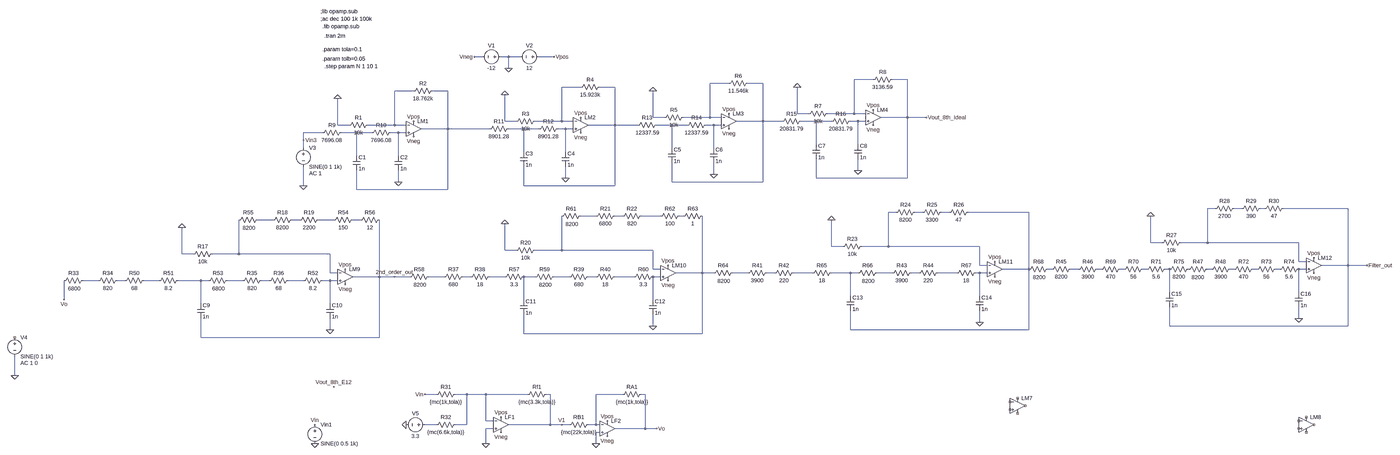
[diagram p0: schematic ESP Prac 1 Chebyshev 8th order Anti-Aliasing Filter.asc, whole sheet]
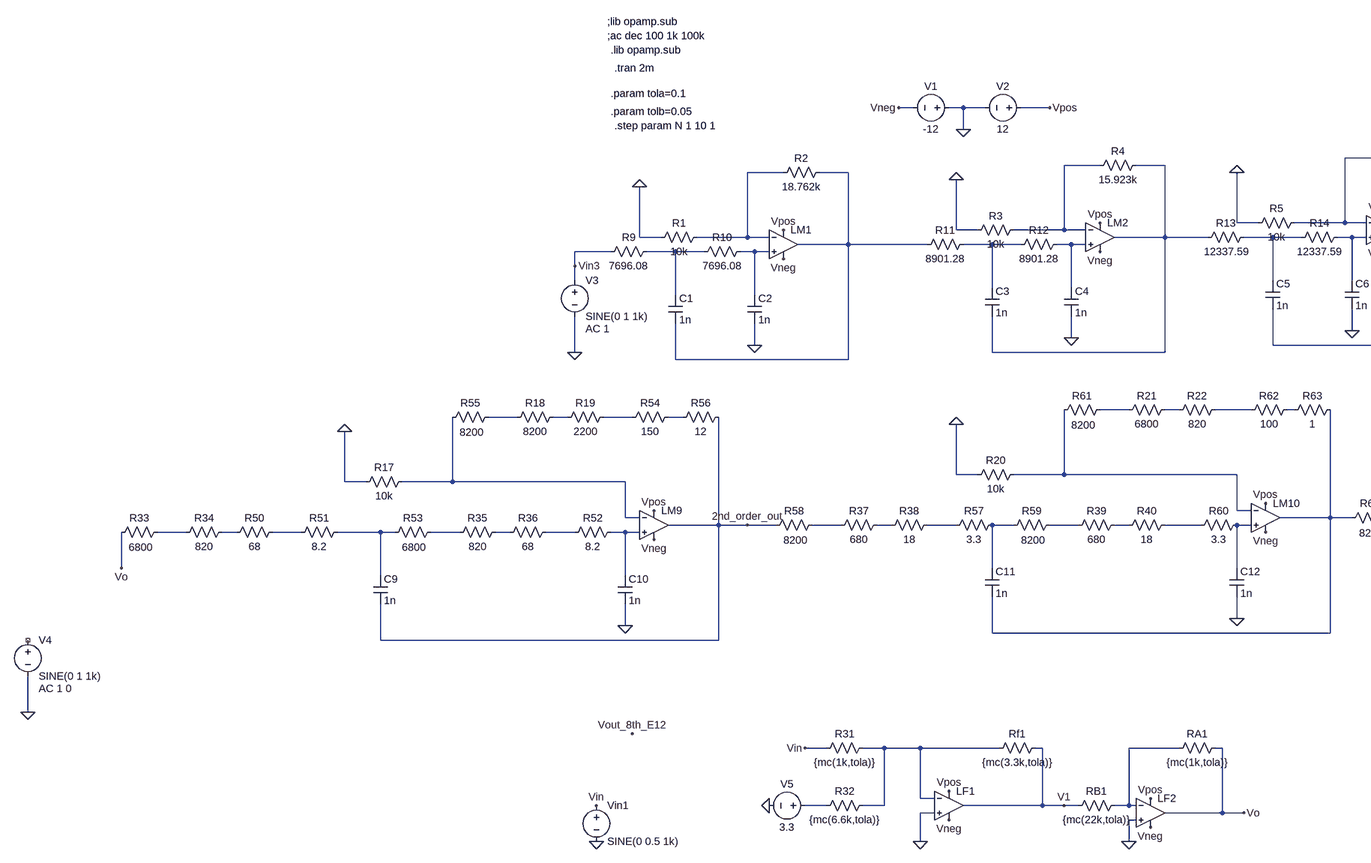
[diagram p1: schematic ESP Prac 1 Chebyshev 8th order Anti-Aliasing Filter.asc, part, row 1 of 1, column 1 of 2]
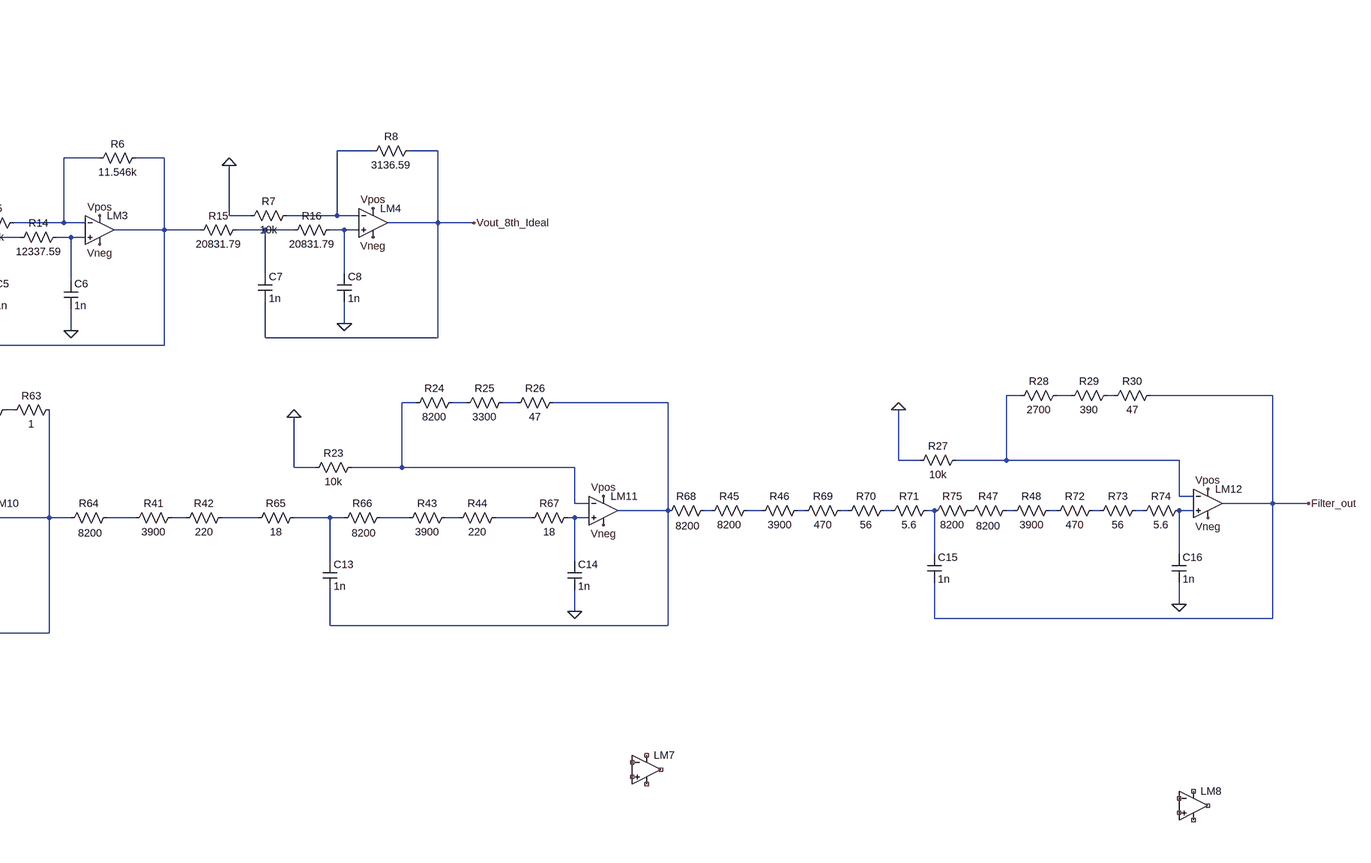
[diagram p2: schematic ESP Prac 1 Chebyshev 8th order Anti-Aliasing Filter.asc, part, row 1 of 1, column 2 of 2]
ESP Prac 1 Chebyshev 8th order Anti-Aliasing Filter.asc, the LTspice schematic file:
Version 4
SHEET 1 3480 1720
WIRE -432 16 -464 16
WIRE -320 16 -352 16
WIRE -272 16 -320 16
WIRE -128 16 -192 16
WIRE -320 64 -320 16
WIRE 1216 112 1136 112
WIRE 1360 112 1296 112
WIRE 608 128 528 128
WIRE 752 128 688 128
WIRE -16 144 -96 144
WIRE 128 144 64 144
WIRE -720 160 -800 160
WIRE -576 160 -640 160
WIRE 896 256 896 144
WIRE 944 256 896 256
WIRE 1136 256 1136 112
WIRE 1136 256 1024 256
WIRE 1184 256 1136 256
WIRE 288 272 288 160
WIRE 336 272 288 272
WIRE 528 272 528 128
WIRE 528 272 416 272
WIRE 576 272 528 272
WIRE 1360 272 1360 112
WIRE 1360 272 1248 272
WIRE 1440 272 1360 272
WIRE -336 288 -336 176
WIRE -288 288 -336 288
WIRE -96 288 -96 144
WIRE -96 288 -208 288
WIRE -48 288 -96 288
WIRE 752 288 752 128
WIRE 752 288 640 288
WIRE 832 288 752 288
WIRE 976 288 912 288
WIRE 1040 288 976 288
WIRE 1152 288 1120 288
WIRE 1184 288 1152 288
WIRE -1040 304 -1040 192
WIRE -992 304 -1040 304
WIRE -800 304 -800 160
WIRE -800 304 -912 304
WIRE -752 304 -800 304
WIRE 128 304 128 144
WIRE 128 304 16 304
WIRE 224 304 128 304
WIRE 368 304 304 304
WIRE 432 304 368 304
WIRE 544 304 512 304
WIRE 576 304 544 304
WIRE -576 320 -576 160
WIRE -576 320 -688 320
WIRE -400 320 -576 320
WIRE -256 320 -320 320
WIRE -192 320 -256 320
WIRE -80 320 -112 320
WIRE -48 320 -80 320
WIRE -1104 336 -1184 336
WIRE -960 336 -1024 336
WIRE -896 336 -960 336
WIRE -784 336 -816 336
WIRE -752 336 -784 336
WIRE -1184 368 -1184 336
WIRE 976 384 976 288
WIRE 1152 384 1152 288
WIRE -1184 400 -1184 368
WIRE 368 400 368 304
WIRE 544 400 544 304
WIRE -256 416 -256 320
WIRE -80 416 -80 320
WIRE -960 432 -960 336
WIRE -784 432 -784 336
WIRE 1152 496 1152 448
WIRE 544 512 544 464
WIRE -80 528 -80 480
WIRE 976 528 976 448
WIRE 1360 528 1360 272
WIRE 1360 528 976 528
WIRE -784 544 -784 496
WIRE 368 544 368 464
WIRE 752 544 752 288
WIRE 752 544 368 544
WIRE -1184 560 -1184 480
WIRE -256 560 -256 480
WIRE 128 560 128 304
WIRE 128 560 -256 560
WIRE -960 576 -960 496
WIRE -576 576 -576 320
WIRE -576 576 -960 576
WIRE 2656 656 2624 656
WIRE 2768 656 2736 656
WIRE 2864 656 2848 656
WIRE 3216 656 2944 656
WIRE 1312 672 1280 672
WIRE 1424 672 1392 672
WIRE 1536 672 1504 672
WIRE 1872 672 1616 672
WIRE 48 688 -16 688
WIRE 160 688 128 688
WIRE 320 688 240 688
WIRE 416 688 400 688
WIRE -1312 704 -1376 704
WIRE -1200 704 -1232 704
WIRE -1056 704 -1120 704
WIRE -944 704 -976 704
WIRE 2384 800 2384 688
WIRE 2432 800 2384 800
WIRE 2624 800 2624 656
WIRE 2624 800 2512 800
WIRE 3008 800 2624 800
WIRE 1040 816 1040 704
WIRE 1088 816 1040 816
WIRE 1280 816 1280 672
WIRE 1280 816 1168 816
WIRE 1664 816 1280 816
WIRE -336 832 -336 720
WIRE -288 832 -336 832
WIRE -96 832 -96 688
WIRE -96 832 -208 832
WIRE 288 832 -96 832
WIRE -1696 848 -1696 736
WIRE -1648 848 -1696 848
WIRE -1456 848 -1456 704
WIRE -1456 848 -1568 848
WIRE -1072 848 -1456 848
WIRE 3008 880 3008 800
WIRE 3040 880 3008 880
WIRE 1664 896 1664 816
WIRE 1696 896 1664 896
WIRE 3216 896 3216 656
WIRE 3216 896 3104 896
WIRE 3296 896 3216 896
WIRE 288 912 288 832
WIRE 320 912 288 912
WIRE 1872 912 1872 672
WIRE 1872 912 1760 912
WIRE 1968 912 1952 912
WIRE 2080 912 2048 912
WIRE 2176 912 2160 912
WIRE 2272 912 2256 912
WIRE 2368 912 2352 912
WIRE 2464 912 2448 912
WIRE 2640 912 2624 912
WIRE 2736 912 2720 912
WIRE 2832 912 2816 912
WIRE 2928 912 2912 912
WIRE 3040 912 3008 912
WIRE -1072 928 -1072 848
WIRE -1040 928 -1072 928
WIRE 496 928 496 688
WIRE 496 928 384 928
WIRE 544 928 496 928
WIRE 688 928 624 928
WIRE 800 928 768 928
WIRE 960 928 880 928
WIRE 1120 928 1040 928
WIRE 1152 928 1120 928
WIRE 1296 928 1232 928
WIRE 1408 928 1376 928
WIRE 1568 928 1488 928
WIRE 1664 928 1648 928
WIRE 1696 928 1664 928
WIRE -864 944 -864 704
WIRE -864 944 -976 944
WIRE -800 944 -864 944
WIRE -736 944 -800 944
WIRE -592 944 -656 944
WIRE -480 944 -512 944
WIRE -336 944 -400 944
WIRE -208 944 -256 944
WIRE -64 944 -128 944
WIRE 48 944 16 944
WIRE 208 944 128 944
WIRE 320 944 288 944
WIRE -2048 960 -2112 960
WIRE -1936 960 -1968 960
WIRE -1792 960 -1856 960
WIRE -1616 960 -1712 960
WIRE -1584 960 -1616 960
WIRE -1440 960 -1504 960
WIRE -1328 960 -1360 960
WIRE -1184 960 -1248 960
WIRE -1072 960 -1104 960
WIRE -1040 960 -1072 960
WIRE 2464 1008 2464 912
WIRE 3008 1008 3008 912
WIRE 1120 1024 1120 928
WIRE 1664 1024 1664 928
WIRE -2192 1040 -2192 960
WIRE -256 1040 -256 944
WIRE 288 1040 288 944
WIRE -1616 1056 -1616 960
WIRE -1072 1056 -1072 960
WIRE 3008 1120 3008 1072
WIRE 1664 1136 1664 1088
WIRE 288 1152 288 1104
WIRE 2464 1152 2464 1072
WIRE 3216 1152 3216 896
WIRE 3216 1152 2464 1152
WIRE -1072 1168 -1072 1120
WIRE 1120 1168 1120 1088
WIRE 1872 1168 1872 912
WIRE 1872 1168 1120 1168
WIRE -256 1184 -256 1104
WIRE 496 1184 496 928
WIRE 496 1184 -256 1184
WIRE -1616 1200 -1616 1120
WIRE -864 1200 -864 944
WIRE -864 1200 -1616 1200
WIRE -2400 1360 -2400 1280
WIRE -624 1440 -672 1440
WIRE -496 1440 -544 1440
WIRE -416 1440 -496 1440
WIRE -240 1440 -416 1440
WIRE -144 1440 -160 1440
WIRE 160 1440 48 1440
WIRE 256 1440 240 1440
WIRE -416 1552 -416 1440
WIRE -384 1552 -416 1552
WIRE -624 1568 -672 1568
WIRE -496 1568 -496 1440
WIRE -496 1568 -544 1568
WIRE -144 1568 -144 1440
WIRE -144 1568 -320 1568
WIRE -96 1568 -144 1568
WIRE -64 1568 -96 1568
WIRE 48 1568 48 1440
WIRE 48 1568 16 1568
WIRE 64 1568 48 1568
WIRE -384 1584 -416 1584
WIRE 256 1584 256 1440
WIRE 256 1584 128 1584
WIRE 304 1584 256 1584
WIRE 64 1600 48 1600
WIRE -416 1648 -416 1584
WIRE 48 1648 48 1600
FLAG -320 64 0
FLAG -128 16 Vpos
FLAG -464 16 Vneg
FLAG -784 544 0
FLAG -1040 192 0
FLAG -1184 560 0
FLAG -80 528 0
FLAG -336 176 0
FLAG 544 512 0
FLAG 288 160 0
FLAG 1152 496 0
FLAG 896 144 0
FLAG -720 288 Vpos
FLAG -16 272 Vpos
FLAG 608 256 Vpos
FLAG 1216 240 Vpos
FLAG 1216 304 Vneg
FLAG 608 320 Vneg
FLAG -16 336 Vneg
FLAG -720 352 Vneg
FLAG 1440 272 Vout_8th_Ideal
FLAG -1184 368 Vin3
FLAG -1072 1168 0
FLAG -1696 736 0
FLAG -2400 1360 0
FLAG -1008 976 Vneg
FLAG -1008 912 Vpos
FLAG 288 1152 0
FLAG -336 720 0
FLAG 352 960 Vneg
FLAG 352 896 Vpos
FLAG 1664 1136 0
FLAG 1040 704 0
FLAG 1728 944 Vneg
FLAG 1728 880 Vpos
FLAG 3008 1120 0
FLAG 2384 688 0
FLAG 3072 928 Vneg
FLAG 3072 864 Vpos
FLAG 3296 896 Filter_out
FLAG -416 1648 0
FLAG -352 1600 Vneg
FLAG -352 1536 Vpos
FLAG -672 1440 Vin
FLAG 304 1584 Vo
FLAG 48 1648 0
FLAG 96 1552 Vpos
FLAG 96 1616 Vneg
FLAG -96 1568 V1
FLAG -1056 1408 Vout_8th_E12
FLAG -800 944 2nd_order_out
FLAG -752 1568 0
FLAG -1136 1648 0
FLAG -1136 1568 Vin
FLAG -2192 1040 Vo
DATAFLAG -512 320 ""
DATAFLAG -512 320 ""
DATAFLAG 192 304 ""
DATAFLAG 192 304 ""
DATAFLAG 816 288 ""
DATAFLAG 816 288 ""
DATAFLAG 3280 896 ""
DATAFLAG 3280 896 ""
SYMBOL voltage -336 16 R90
WINDOW 0 -32 56 VBottom 2
WINDOW 3 32 56 VTop 2
WINDOW 123 0 0 Left 0
WINDOW 39 0 0 Left 0
SYMATTR InstName V1
SYMATTR Value -12
SYMBOL voltage -176 16 R90
WINDOW 0 -32 56 VBottom 2
WINDOW 3 32 56 VTop 2
WINDOW 123 0 0 Left 0
WINDOW 39 0 0 Left 0
SYMATTR InstName V2
SYMATTR Value 12
SYMBOL res -896 288 R90
WINDOW 0 0 56 VBottom 2
WINDOW 3 32 56 VTop 2
SYMATTR InstName R1
SYMATTR Value 10k
SYMBOL res -624 144 R90
WINDOW 0 0 56 VBottom 2
WINDOW 3 32 56 VTop 2
SYMATTR InstName R2
SYMATTR Value 18.762k
SYMBOL cap -976 432 R0
SYMATTR InstName C1
SYMATTR Value 1n
SYMBOL cap -800 432 R0
SYMATTR InstName C2
SYMATTR Value 1n
SYMBOL voltage -1184 384 R0
WINDOW 123 24 124 Left 2
WINDOW 39 0 0 Left 0
SYMATTR Value2 AC 1
SYMATTR InstName V3
SYMATTR Value SINE(0 1 1k)
SYMBOL res -192 272 R90
WINDOW 0 0 56 VBottom 2
WINDOW 3 32 56 VTop 2
SYMATTR InstName R3
SYMATTR Value 10k
SYMBOL res 80 128 R90
WINDOW 0 0 56 VBottom 2
WINDOW 3 32 56 VTop 2
SYMATTR InstName R4
SYMATTR Value 15.923k
SYMBOL cap -272 416 R0
SYMATTR InstName C3
SYMATTR Value 1n
SYMBOL cap -96 416 R0
SYMATTR InstName C4
SYMATTR Value 1n
SYMBOL res 432 256 R90
WINDOW 0 0 56 VBottom 2
WINDOW 3 32 56 VTop 2
SYMATTR InstName R5
SYMATTR Value 10k
SYMBOL res 704 112 R90
WINDOW 0 0 56 VBottom 2
WINDOW 3 32 56 VTop 2
SYMATTR InstName R6
SYMATTR Value 11.546k
SYMBOL cap 352 400 R0
SYMATTR InstName C5
SYMATTR Value 1n
SYMBOL cap 528 400 R0
SYMATTR InstName C6
SYMATTR Value 1n
SYMBOL res 1040 240 R90
WINDOW 0 0 56 VBottom 2
WINDOW 3 32 56 VTop 2
SYMATTR InstName R7
SYMATTR Value 10k
SYMBOL res 1312 96 R90
WINDOW 0 0 56 VBottom 2
WINDOW 3 32 56 VTop 2
SYMATTR InstName R8
SYMATTR Value 3136.59
SYMBOL cap 960 384 R0
SYMATTR InstName C7
SYMATTR Value 1n
SYMBOL cap 1136 384 R0
SYMATTR InstName C8
SYMATTR Value 1n
SYMBOL Opamps\\UniversalOpamp2 -720 320 R0
SYMATTR InstName LM1
SYMATTR SpiceModel level.1
SYMATTR Value2 Avol=0.1Meg GBW=4Meg Slew=13
SYMATTR SpiceLine ilimit=25m rail=0 Vos=10m phimargin=45
SYMATTR SpiceLine2 en=0 enk=0 in=0 ink=0 Rin=1000000Meg
SYMBOL res -1008 320 R90
WINDOW 0 0 56 VBottom 2
WINDOW 3 32 56 VTop 2
SYMATTR InstName R9
SYMATTR Value 7696.08
SYMBOL res -800 320 R90
WINDOW 0 0 56 VBottom 2
WINDOW 3 32 56 VTop 2
SYMATTR InstName R10
SYMATTR Value 7696.08
SYMBOL res -304 304 R90
WINDOW 0 0 56 VBottom 2
WINDOW 3 32 56 VTop 2
SYMATTR InstName R11
SYMATTR Value 8901.28
SYMBOL res -96 304 R90
WINDOW 0 0 56 VBottom 2
WINDOW 3 32 56 VTop 2
SYMATTR InstName R12
SYMATTR Value 8901.28
SYMBOL res 320 288 R90
WINDOW 0 0 56 VBottom 2
WINDOW 3 32 54 VTop 2
SYMATTR InstName R13
SYMATTR Value 12337.59
SYMBOL res 528 288 R90
WINDOW 0 0 56 VBottom 2
WINDOW 3 32 56 VTop 2
SYMATTR InstName R14
SYMATTR Value 12337.59
SYMBOL res 928 272 R90
WINDOW 0 0 56 VBottom 2
WINDOW 3 32 56 VTop 2
SYMATTR InstName R15
SYMATTR Value 20831.79
SYMBOL res 1136 272 R90
WINDOW 0 0 56 VBottom 2
WINDOW 3 32 56 VTop 2
SYMATTR InstName R16
SYMATTR Value 20831.79
SYMBOL Opamps\\UniversalOpamp2 -16 304 R0
SYMATTR InstName LM2
SYMATTR SpiceModel level.1
SYMATTR Value2 Avol=0.1Meg GBW=4Meg Slew=13
SYMATTR SpiceLine ilimit=25m rail=0 Vos=10m phimargin=45
SYMATTR SpiceLine2 en=0 enk=0 in=0 ink=0 Rin=1000000Meg
SYMBOL Opamps\\UniversalOpamp2 608 288 R0
SYMATTR InstName LM3
SYMATTR SpiceModel level.1
SYMATTR Value2 Avol=0.1Meg GBW=4Meg Slew=13
SYMATTR SpiceLine ilimit=25m rail=0 Vos=10m phimargin=45
SYMATTR SpiceLine2 en=0 enk=0 in=0 ink=0 Rin=1000000Meg
SYMBOL Opamps\\UniversalOpamp2 1216 272 R0
SYMATTR InstName LM4
SYMATTR SpiceModel level.1
SYMATTR Value2 Avol=0.1Meg GBW=4Meg Slew=13
SYMATTR SpiceLine ilimit=25m rail=0 Vos=10m phimargin=45
SYMATTR SpiceLine2 en=0 enk=0 in=0 ink=0 Rin=1000000Meg
SYMBOL res -1552 832 R90
WINDOW 0 0 56 VBottom 2
WINDOW 3 32 56 VTop 2
SYMATTR InstName R17
SYMATTR Value 10k
SYMBOL cap -1632 1056 R0
SYMATTR InstName C9
SYMATTR Value 1n
SYMBOL cap -1088 1056 R0
SYMATTR InstName C10
SYMATTR Value 1n
SYMBOL voltage -2400 1184 R0
WINDOW 123 24 124 Left 2
WINDOW 39 0 0 Left 0
SYMATTR Value2 AC 1 0
SYMATTR InstName V4
SYMATTR Value SINE(0 1 1k)
SYMBOL res -192 816 R90
WINDOW 0 0 56 VBottom 2
WINDOW 3 32 56 VTop 2
SYMATTR InstName R20
SYMATTR Value 10k
SYMBOL cap -272 1040 R0
SYMATTR InstName C11
SYMATTR Value 1n
SYMBOL cap 272 1040 R0
SYMATTR InstName C12
SYMATTR Value 1n
SYMBOL res 1184 800 R90
WINDOW 0 0 56 VBottom 2
WINDOW 3 32 56 VTop 2
SYMATTR InstName R23
SYMATTR Value 10k
SYMBOL cap 1104 1024 R0
SYMATTR InstName C13
SYMATTR Value 1n
SYMBOL cap 1648 1024 R0
SYMATTR InstName C14
SYMATTR Value 1n
SYMBOL Opamps\\UniversalOpamp2 1824 1488 R0
SYMATTR InstName LM7
SYMATTR SpiceModel level.1
SYMATTR Value2 Avol=1Meg GBW=1Meg Slew=0.5
SYMATTR SpiceLine ilimit=25m rail=0 Vos=7m phimargin=45
SYMBOL res 1408 656 R90
WINDOW 0 0 56 VBottom 2
WINDOW 3 32 56 VTop 2
SYMATTR InstName R24
SYMATTR Value 8200
SYMBOL res 1520 656 R90
WINDOW 0 0 56 VBottom 2
WINDOW 3 32 56 VTop 2
SYMATTR InstName R25
SYMATTR Value 3300
SYMBOL res 1632 656 R90
WINDOW 0 0 56 VBottom 2
WINDOW 3 32 56 VTop 2
SYMATTR InstName R26
SYMATTR Value 47
SYMBOL res 2528 784 R90
WINDOW 0 0 56 VBottom 2
WINDOW 3 32 56 VTop 2
SYMATTR InstName R27
SYMATTR Value 10k
SYMBOL cap 2448 1008 R0
SYMATTR InstName C15
SYMATTR Value 1n
SYMBOL cap 2992 1008 R0
SYMATTR InstName C16
SYMATTR Value 1n
SYMBOL Opamps\\UniversalOpamp2 3040 1568 R0
SYMATTR InstName LM8
SYMATTR SpiceModel level.1
SYMATTR Value2 Avol=1Meg GBW=1Meg Slew=0.5
SYMATTR SpiceLine ilimit=25m rail=0 Vos=7m phimargin=45
SYMBOL res 2752 640 R90
WINDOW 0 0 56 VBottom 2
WINDOW 3 32 56 VTop 2
SYMATTR InstName R28
SYMATTR Value 2700
SYMBOL res 2864 640 R90
WINDOW 0 0 56 VBottom 2
WINDOW 3 32 56 VTop 2
SYMATTR InstName R29
SYMATTR Value 390
SYMBOL res 2960 640 R90
WINDOW 0 0 56 VBottom 2
WINDOW 3 32 56 VTop 2
SYMATTR InstName R30
SYMATTR Value 47
SYMBOL res -2096 944 R90
WINDOW 0 0 56 VBottom 2
WINDOW 3 34 53 VTop 2
SYMATTR InstName R33
SYMATTR Value 6800
SYMBOL res -1952 944 R90
WINDOW 0 0 56 VBottom 2
WINDOW 3 32 56 VTop 2
SYMATTR InstName R34
SYMATTR Value 820
SYMBOL res -1840 944 R90
WINDOW 0 0 56 VBottom 2
WINDOW 3 32 56 VTop 2
SYMATTR InstName R50
SYMATTR Value 68
SYMBOL res -1696 944 R90
WINDOW 0 0 56 VBottom 2
WINDOW 3 32 56 VTop 2
SYMATTR InstName R51
SYMATTR Value 8.2
SYMBOL res -1344 944 R90
WINDOW 0 0 56 VBottom 2
WINDOW 3 32 56 VTop 2
SYMATTR InstName R35
SYMATTR Value 820
SYMBOL res -1232 944 R90
WINDOW 0 0 56 VBottom 2
WINDOW 3 32 56 VTop 2
SYMATTR InstName R36
SYMATTR Value 68
SYMBOL res -1088 944 R90
WINDOW 0 0 56 VBottom 2
WINDOW 3 32 56 VTop 2
SYMATTR InstName R52
SYMATTR Value 8.2
SYMBOL res -1488 944 R90
WINDOW 0 0 56 VBottom 2
WINDOW 3 34 53 VTop 2
SYMATTR InstName R53
SYMATTR Value 6800
SYMBOL res -1216 688 R90
WINDOW 0 0 56 VBottom 2
WINDOW 3 32 56 VTop 2
SYMATTR InstName R18
SYMATTR Value 8200
SYMBOL res -1104 688 R90
WINDOW 0 0 56 VBottom 2
WINDOW 3 32 56 VTop 2
SYMATTR InstName R19
SYMATTR Value 2200
SYMBOL res -960 688 R90
WINDOW 0 0 56 VBottom 2
WINDOW 3 32 56 VTop 2
SYMATTR InstName R54
SYMATTR Value 150
SYMBOL res -1360 688 R90
WINDOW 0 0 56 VBottom 2
WINDOW 3 34 53 VTop 2
SYMATTR InstName R55
SYMATTR Value 8200
SYMBOL res -848 688 R90
WINDOW 0 0 56 VBottom 2
WINDOW 3 32 56 VTop 2
SYMATTR InstName R56
SYMATTR Value 12
SYMBOL res -496 928 R90
WINDOW 0 0 56 VBottom 2
WINDOW 3 32 56 VTop 2
SYMATTR InstName R37
SYMATTR Value 680
SYMBOL res -384 928 R90
WINDOW 0 0 56 VBottom 2
WINDOW 3 32 56 VTop 2
SYMATTR InstName R38
SYMATTR Value 18
SYMBOL res -240 928 R90
WINDOW 0 0 56 VBottom 2
WINDOW 3 32 56 VTop 2
SYMATTR InstName R57
SYMATTR Value 3.3
SYMBOL res -640 928 R90
WINDOW 0 0 56 VBottom 2
WINDOW 3 34 53 VTop 2
SYMATTR InstName R58
SYMATTR Value 8200
SYMBOL res 32 928 R90
WINDOW 0 0 56 VBottom 2
WINDOW 3 32 56 VTop 2
SYMATTR InstName R39
SYMATTR Value 680
SYMBOL res 144 928 R90
WINDOW 0 0 56 VBottom 2
WINDOW 3 32 56 VTop 2
SYMATTR InstName R40
SYMATTR Value 18
SYMBOL res -112 928 R90
WINDOW 0 0 56 VBottom 2
WINDOW 3 34 53 VTop 2
SYMATTR InstName R59
SYMATTR Value 8200
SYMBOL res 304 928 R90
WINDOW 0 0 56 VBottom 2
WINDOW 3 32 56 VTop 2
SYMATTR InstName R60
SYMATTR Value 3.3
SYMBOL res 144 672 R90
WINDOW 0 0 56 VBottom 2
WINDOW 3 32 56 VTop 2
SYMATTR InstName R21
SYMATTR Value 6800
SYMBOL res 256 672 R90
WINDOW 0 0 56 VBottom 2
WINDOW 3 32 56 VTop 2
SYMATTR InstName R22
SYMATTR Value 820
SYMBOL res 0 672 R90
WINDOW 0 0 56 VBottom 2
WINDOW 3 34 53 VTop 2
SYMATTR InstName R61
SYMATTR Value 8200
SYMBOL res 416 672 R90
WINDOW 0 0 56 VBottom 2
WINDOW 3 32 56 VTop 2
SYMATTR InstName R62
SYMATTR Value 100
SYMBOL res 512 672 R90
WINDOW 0 0 56 VBottom 2
WINDOW 3 32 56 VTop 2
SYMATTR InstName R63
SYMATTR Value 1
SYMBOL res 784 912 R90
WINDOW 0 0 56 VBottom 2
WINDOW 3 32 56 VTop 2
SYMATTR InstName R41
SYMATTR Value 3900
SYMBOL res 896 912 R90
WINDOW 0 0 56 VBottom 2
WINDOW 3 32 56 VTop 2
SYMATTR InstName R42
SYMATTR Value 220
SYMBOL res 640 912 R90
WINDOW 0 0 56 VBottom 2
WINDOW 3 34 53 VTop 2
SYMATTR InstName R64
SYMATTR Value 8200
SYMBOL res 1056 912 R90
WINDOW 0 0 56 VBottom 2
WINDOW 3 32 56 VTop 2
SYMATTR InstName R65
SYMATTR Value 18
SYMBOL res 1392 912 R90
WINDOW 0 0 56 VBottom 2
WINDOW 3 32 56 VTop 2
SYMATTR InstName R43
SYMATTR Value 3900
SYMBOL res 1504 912 R90
WINDOW 0 0 56 VBottom 2
WINDOW 3 32 56 VTop 2
SYMATTR InstName R44
SYMATTR Value 220
SYMBOL res 1248 912 R90
WINDOW 0 0 56 VBottom 2
WINDOW 3 34 53 VTop 2
SYMATTR InstName R66
SYMATTR Value 8200
SYMBOL res 1664 912 R90
WINDOW 0 0 56 VBottom 2
WINDOW 3 32 56 VTop 2
SYMATTR InstName R67
SYMATTR Value 18
SYMBOL res 2064 896 R90
WINDOW 0 0 56 VBottom 2
WINDOW 3 32 56 VTop 2
SYMATTR InstName R45
SYMATTR Value 8200
SYMBOL res 2176 896 R90
WINDOW 0 0 56 VBottom 2
WINDOW 3 32 56 VTop 2
SYMATTR InstName R46
SYMATTR Value 3900
SYMBOL res 1968 896 R90
WINDOW 0 0 56 VBottom 2
WINDOW 3 34 53 VTop 2
SYMATTR InstName R68
SYMATTR Value 8200
SYMBOL res 2272 896 R90
WINDOW 0 0 56 VBottom 2
WINDOW 3 32 56 VTop 2
SYMATTR InstName R69
SYMATTR Value 470
SYMBOL res 2368 896 R90
WINDOW 0 0 56 VBottom 2
WINDOW 3 32 56 VTop 2
SYMATTR InstName R70
SYMATTR Value 56
SYMBOL res 2464 896 R90
WINDOW 0 0 56 VBottom 2
WINDOW 3 32 56 VTop 2
SYMATTR InstName R71
SYMATTR Value 5.6
SYMBOL res 2640 896 R90
WINDOW 0 0 56 VBottom 2
WINDOW 3 34 56 VTop 2
SYMATTR InstName R47
SYMATTR Value 8200
SYMBOL res 2736 896 R90
WINDOW 0 0 56 VBottom 2
WINDOW 3 32 56 VTop 2
SYMATTR InstName R48
SYMATTR Value 3900
SYMBOL res 2832 896 R90
WINDOW 0 0 56 VBottom 2
WINDOW 3 32 56 VTop 2
SYMATTR InstName R72
SYMATTR Value 470
SYMBOL res 2928 896 R90
WINDOW 0 0 56 VBottom 2
WINDOW 3 32 56 VTop 2
SYMATTR InstName R73
SYMATTR Value 56
SYMBOL res 3024 896 R90
WINDOW 0 0 56 VBottom 2
WINDOW 3 32 56 VTop 2
SYMATTR InstName R74
SYMATTR Value 5.6
SYMBOL res 2560 896 R90
WINDOW 0 0 56 VBottom 2
WINDOW 3 32 56 VTop 2
SYMATTR InstName R75
SYMATTR Value 8200
SYMBOL Opamps\\UniversalOpamp2 -1008 944 R0
SYMATTR InstName LM9
SYMATTR SpiceModel level.1
SYMATTR Value2 Avol=0.1Meg GBW=4Meg Slew=13
SYMATTR SpiceLine ilimit=25m rail=0 Vos=10m phimargin=45
SYMATTR SpiceLine2 en=0 enk=0 in=0 ink=0 Rin=1000000Meg
SYMBOL Opamps\\UniversalOpamp2 352 928 R0
SYMATTR InstName LM10
SYMATTR SpiceModel level.1
SYMATTR Value2 Avol=0.1Meg GBW=4Meg Slew=13
SYMATTR SpiceLine ilimit=25m rail=0 Vos=10m phimargin=45
SYMATTR SpiceLine2 en=0 enk=0 in=0 ink=0 Rin=1000000Meg
SYMBOL Opamps\\UniversalOpamp2 1728 912 R0
SYMATTR InstName LM11
SYMATTR SpiceModel level.1
SYMATTR Value2 Avol=0.1Meg GBW=4Meg Slew=13
SYMATTR SpiceLine ilimit=25m rail=0 Vos=10m phimargin=45
SYMATTR SpiceLine2 en=0 enk=0 in=0 ink=0 Rin=1000000Meg
SYMBOL Opamps\\UniversalOpamp2 3072 896 R0
SYMATTR InstName LM12
SYMATTR SpiceModel level.1
SYMATTR Value2 Avol=0.1Meg GBW=4Meg Slew=13
SYMATTR SpiceLine ilimit=25m rail=0 Vos=10m phimargin=45
SYMATTR SpiceLine2 en=0 enk=0 in=0 ink=0 Rin=1000000Meg
SYMBOL Opamps\\UniversalOpamp2 -352 1568 R0
SYMATTR InstName LF1
SYMATTR SpiceModel level.1
SYMATTR Value2 Avol=0.1Meg GBW=4Meg Slew=13
SYMATTR SpiceLine ilimit=25m rail=0 Vos=10m phimargin=45
SYMATTR SpiceLine2 en=0 enk=0 in=0 ink=0 Rin=1000000Meg
SYMBOL res -528 1424 R90
WINDOW 0 0 56 VBottom 2
WINDOW 3 32 56 VTop 2
SYMATTR InstName R31
SYMATTR Value {mc(1k,tola)}
SYMBOL res -144 1424 R90
WINDOW 0 0 56 VBottom 2
WINDOW 3 32 56 VTop 2
SYMATTR InstName Rf1
SYMATTR Value {mc(3.3k,tola)}
SYMBOL res -528 1552 R90
WINDOW 0 0 56 VBottom 2
WINDOW 3 32 56 VTop 2
SYMATTR InstName R32
SYMATTR Value {mc(6.6k,tola)}
SYMBOL Opamps\\UniversalOpamp2 96 1584 R0
SYMATTR InstName LF2
SYMATTR SpiceModel level.1
SYMATTR Value2 Avol=0.1Meg GBW=4Meg Slew=13
SYMATTR SpiceLine ilimit=25m rail=0 Vos=10m phimargin=45
SYMATTR SpiceLine2 en=0 enk=0 in=0 ink=0 Rin=1000000Meg
SYMBOL res 32 1552 R90
WINDOW 0 0 56 VBottom 2
WINDOW 3 32 56 VTop 2
SYMATTR InstName RB1
SYMATTR Value {mc(22k,tola)}
SYMBOL res 256 1424 R90
WINDOW 0 0 56 VBottom 2
WINDOW 3 32 56 VTop 2
SYMATTR InstName RA1
SYMATTR Value {mc(1k,tola)}
SYMBOL voltage -656 1568 R90
WINDOW 0 -32 56 VBottom 2
WINDOW 3 32 56 VTop 2
WINDOW 123 0 0 Left 0
WINDOW 39 0 0 Left 0
SYMATTR InstName V5
SYMATTR Value 3.3
SYMBOL voltage -1136 1552 R0
WINDOW 123 0 0 Left 0
WINDOW 39 0 0 Left 0
SYMATTR InstName Vin1
SYMATTR Value SINE(0 0.5 1k)
TEXT -1112 -176 Left 2 !;lib opamp.sub
TEXT -1112 -144 Left 2 !;ac dec 100 1k 100k
TEXT -1104 -112 Left 2 !.lib opamp.sub
TEXT -1096 -72 Left 2 !.tran 2m
TEXT -1104 -16 Left 2 !.param tola=0.1
TEXT -1104 24 Left 2 !.param tolb=0.05
TEXT -1096 56 Left 2 !.step param N 1 10 1

The netlist it stands for:
* ESP Prac 1 Chebyshev 8th order Anti-Aliasing Filter.asc
V1 0 Vneg -12
V2 Vpos 0 12
R1 N006 0 10k
R2 N007 N006 18.762k
C1 N014 N007 1n
C2 N015 0 1n
V3 Vin3 0 SINE(0 1 1k) AC 1
R3 N004 0 10k
R4 N005 N004 15.923k
C3 N012 N005 1n
C4 N013 0 1n
R5 N002 0 10k
R6 N003 N002 11.546k
C5 N010 N003 1n
C6 N011 0 1n
R7 N001 0 10k
R8 Vout_8th_Ideal N001 3136.59
C7 N008 Vout_8th_Ideal 1n
C8 N009 0 1n
XLM1 N015 N006 Vpos Vneg N007 level.1 Avol=0.1Meg GBW=4Meg Slew=13 ilimit=25m rail=0 Vos=10m phimargin=45 en=0 enk=0 in=0 ink=0 Rin=1000000Meg  ; pins IN+ IN- V+ V- OUT
R9 N014 Vin3 7696.08
R10 N015 N014 7696.08
R11 N012 N007 8901.28
R12 N013 N012 8901.28
R13 N010 N005 12337.59
R14 N011 N010 12337.59
R15 N008 N003 20831.79
R16 N009 N008 20831.79
XLM2 N013 N004 Vpos Vneg N005 level.1 Avol=0.1Meg GBW=4Meg Slew=13 ilimit=25m rail=0 Vos=10m phimargin=45 en=0 enk=0 in=0 ink=0 Rin=1000000Meg  ; pins IN+ IN- V+ V- OUT
XLM3 N011 N002 Vpos Vneg N003 level.1 Avol=0.1Meg GBW=4Meg Slew=13 ilimit=25m rail=0 Vos=10m phimargin=45 en=0 enk=0 in=0 ink=0 Rin=1000000Meg  ; pins IN+ IN- V+ V- OUT
XLM4 N009 N001 Vpos Vneg Vout_8th_Ideal level.1 Avol=0.1Meg GBW=4Meg Slew=13 ilimit=25m rail=0 Vos=10m phimargin=45 en=0 enk=0 in=0 ink=0 Rin=1000000Meg  ; pins IN+ IN- V+ V- OUT
R17 N032 0 10k
C9 N064 2nd_order_out 1n
C10 N068 0 1n
V4 NC_01 0 SINE(0 1 1k) AC 1 0
R20 N031 0 10k
C11 N056 N044 1n
C12 N060 0 1n
R23 N019 0 10k
C13 N048 N022 1n
C14 N052 0 1n
XLM7 NC_02 NC_03 NC_04 NC_05 NC_06 level.1 Avol=1Meg GBW=1Meg Slew=0.5 ilimit=25m rail=0 Vos=7m phimargin=45 en=0 enk=0 in=0 ink=0 Rin=500Meg  ; pins IN+ IN- V+ V- OUT
R24 N020 N019 8200
R25 N021 N020 3300
R26 N022 N021 47
R27 N016 0 10k
C15 N038 Filter_out 1n
C16 N043 0 1n
XLM8 NC_07 NC_08 NC_09 NC_10 NC_11 level.1 Avol=1Meg GBW=1Meg Slew=0.5 ilimit=25m rail=0 Vos=7m phimargin=45 en=0 enk=0 in=0 ink=0 Rin=500Meg  ; pins IN+ IN- V+ V- OUT
R28 N017 N016 2700
R29 N018 N017 390
R30 Filter_out N018 47
R33 N061 Vo 6800
R34 N062 N061 820
R50 N063 N062 68
R51 N064 N063 8.2
R35 N066 N065 820
R36 N067 N066 68
R52 N068 N067 8.2
R53 N065 N064 6800
R18 N028 N027 8200
R19 N029 N028 2200
R54 N030 N029 150
R55 N027 N032 8200
R56 2nd_order_out N030 12
R37 N054 N053 680
R38 N055 N054 18
R57 N056 N055 3.3
R58 N053 2nd_order_out 8200
R39 N058 N057 680
R40 N059 N058 18
R59 N057 N056 8200
R60 N060 N059 3.3
R21 N024 N023 6800
R22 N025 N024 820
R61 N023 N031 8200
R62 N026 N025 100
R63 N044 N026 1
R41 N046 N045 3900
R42 N047 N046 220
R64 N045 N044 8200
R65 N048 N047 18
R43 N050 N049 3900
R44 N051 N050 220
R66 N049 N048 8200
R67 N052 N051 18
R45 N034 N033 8200
R46 N035 N034 3900
R68 N033 N022 8200
R69 N036 N035 470
R70 N037 N036 56
R71 N038 N037 5.6
R47 N039 P001 8200
R48 N040 N039 3900
R72 N041 N040 470
R73 N042 N041 56
R74 N043 N042 5.6
R75 P001 N038 8200
XLM9 N068 N032 Vpos Vneg 2nd_order_out level.1 Avol=0.1Meg GBW=4Meg Slew=13 ilimit=25m rail=0 Vos=10m phimargin=45 en=0 enk=0 in=0 ink=0 Rin=1000000Meg  ; pins IN+ IN- V+ V- OUT
XLM10 N060 N031 Vpos Vneg N044 level.1 Avol=0.1Meg GBW=4Meg Slew=13 ilimit=25m rail=0 Vos=10m phimargin=45 en=0 enk=0 in=0 ink=0 Rin=1000000Meg  ; pins IN+ IN- V+ V- OUT
XLM11 N052 N019 Vpos Vneg N022 level.1 Avol=0.1Meg GBW=4Meg Slew=13 ilimit=25m rail=0 Vos=10m phimargin=45 en=0 enk=0 in=0 ink=0 Rin=1000000Meg  ; pins IN+ IN- V+ V- OUT
XLM12 N043 N016 Vpos Vneg Filter_out level.1 Avol=0.1Meg GBW=4Meg Slew=13 ilimit=25m rail=0 Vos=10m phimargin=45 en=0 enk=0 in=0 ink=0 Rin=1000000Meg  ; pins IN+ IN- V+ V- OUT
XLF1 0 N069 Vpos Vneg V1 level.1 Avol=0.1Meg GBW=4Meg Slew=13 ilimit=25m rail=0 Vos=10m phimargin=45 en=0 enk=0 in=0 ink=0 Rin=1000000Meg  ; pins IN+ IN- V+ V- OUT
R31 N069 Vin {mc(1k,tola)}
Rf1 V1 N069 {mc(3.3k,tola)}
R32 N069 N071 {mc(6.6k,tola)}
XLF2 0 N070 Vpos Vneg Vo level.1 Avol=0.1Meg GBW=4Meg Slew=13 ilimit=25m rail=0 Vos=10m phimargin=45 en=0 enk=0 in=0 ink=0 Rin=1000000Meg  ; pins IN+ IN- V+ V- OUT
RB1 N070 V1 {mc(22k,tola)}
RA1 Vo N070 {mc(1k,tola)}
V5 N071 0 3.3
Vin1 Vin 0 SINE(0 0.5 1k)
;lib opamp.sub
;ac dec 100 1k 100k
.lib opamp.sub
.tran 2m
.param tola=0.1
.param tolb=0.05
.step param N 1 10 1
.lib UniversalOpamps2.sub
.backanno
.end